# Altium schematic sheet [02.6] MIC_SE2Diff.SchDoc
size A4
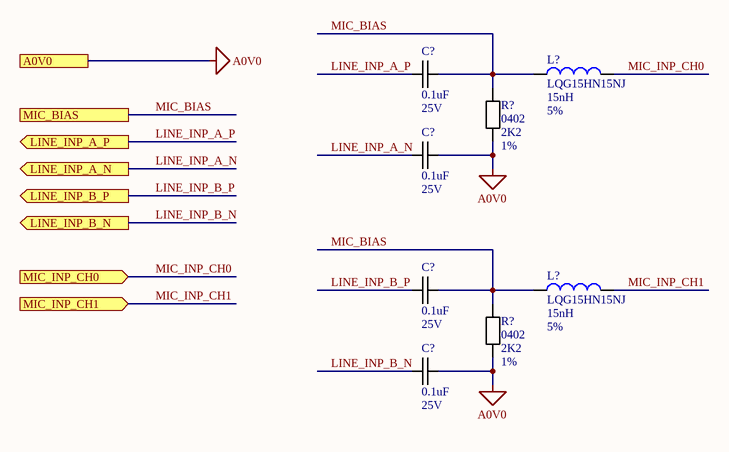
[diagram p0: [02.6] MIC_SE2Diff.SchDoc]

## Parts
(Parts that share a designator on the sheet are numbered #1, #2 ... from top to bottom, then left to right.)
C?#1  value 0.1uF  Voltage: 25V  [LC-0402_C]  (hidden comment: CAP CER 0.1UF 25V X7R 0402)
C?#2  value 0.1uF  Voltage: 25V  [LC-0402_C]  (hidden comment: CAP CER 0.1UF 25V X7R 0402)
C?#3  value 0.1uF  Voltage: 25V  [LC-0402_C]  (hidden comment: CAP CER 0.1UF 25V X7R 0402)
C?#4  value 0.1uF  Voltage: 25V  [LC-0402_C]  (hidden comment: CAP CER 0.1UF 25V X7R 0402)
L?#1  LQG15HN15NJ  value 15nH  Accuracy: 5%  [LC-0402_L]
L?#2  LQG15HN15NJ  value 15nH  Accuracy: 5%  [LC-0402_L]
R?#1  value 2K2  Package: 0402  Accuracy: 1%  [LC-0402_R]  (hidden comment: RES SMD 2.2K OHM 1% 1/16W 0402)
R?#2  value 2K2  Package: 0402  Accuracy: 1%  [LC-0402_R]  (hidden comment: RES SMD 2.2K OHM 1% 1/16W 0402)

## Ports
A0V0, LINE_INP_A_N (out), LINE_INP_A_P (out), LINE_INP_B_N (out), LINE_INP_B_P (out), MIC_BIAS, MIC_INP_CH0 (in), MIC_INP_CH1 (in)

## Nets
A0V0: C?#2.2 C?#4.2 R?#1.1 R?#2.1 ; port A0V0
LINE_INP_A_N: C?#2.1 ; port LINE_INP_A_N
LINE_INP_A_P: C?#1.1 ; port LINE_INP_A_P
LINE_INP_B_N: C?#4.1 ; port LINE_INP_B_N
LINE_INP_B_P: C?#3.1 ; port LINE_INP_B_P
MIC_BIAS: C?#1.2 C?#3.2 L?#1.1 L?#2.1 R?#1.2 R?#2.2 ; port MIC_BIAS
MIC_INP_CH0: L?#1.2 ; port MIC_INP_CH0
MIC_INP_CH1: L?#2.2 ; port MIC_INP_CH1

## Library data of the parts
L?#1 L?#2 = LQG15HN15NJ: 15nH 5% 0402 SMD Chip inductor MURATA
R?#1 R?#2 = RES SMD 2.2K OHM 1% 1/16W 0402: Power dissipation max: 0.0625 W
C?#1-C?#4 = CAP CER 0.1UF 25V X7R 0402: Dielectric: x7r